# Altium schematic sheet liuyang.SchDoc
size A4
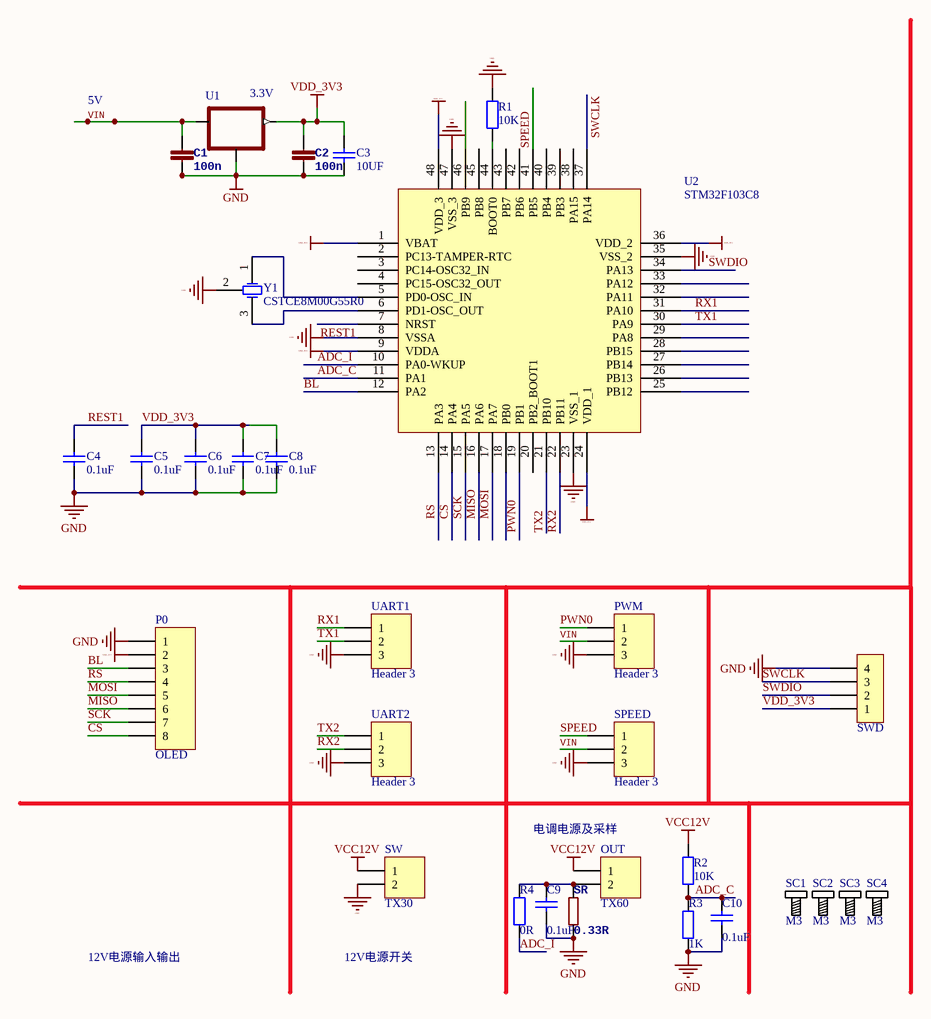
[diagram p0: liuyang.SchDoc]

## Parts
C1  100n  [C0603]
C2  100n  [C0603]
C3  10UF  [C0603]
C4  0.1uF  [C0603]
C5  value 0.1uF  [C0603]  (hidden comment: 10UF)
C6  0.1uF  [C0603]
C7  0.1uF  [C0603]
C8  0.1uF  [C0603]
C9  0.1uF  [C0603]
C10  0.1uF  [C0603]
OUT  TX60  [TX30-m]
P0  OLED  [DF13-1.25-8A]
PWM  Header 3  [DF13-1.25-3A]
R1  10K  [R0603]
R2  10K  [R0603]
R3  value 1K  [R0603]  (hidden comment: 10K)
R4  value 0R  [R0603]  (hidden comment: 10K)
SC1  M3  [SCRREW_M3]
SC2  M3  [SCRREW_M3]
SC3  M3  [SCRREW_M3]
SC4  M3  [SCRREW_M3]
SPEED  Header 3  [DF13-1.25-3A]
SR  0.33R  [R2512]
SW  TX30  [TX30-m]
SWD  CON4  [DF13-1.25-4A]  (value not drawn)
U1  3.3V  [SOT23]
U2  STM32F103C8  [ST_LQFP48]
UART1  Header 3  [DF13-1.25-3A]
UART2  Header 3  [DF13-1.25-3A]
Y1  CSTCE8M00G55R0  [CRYSMD3.2X1.3]

## Nets
GND: C1.2 C2.2 C3.1 C4.1 C5.1 C6.1 C7.1 C8.1 C9.1 C10.1 P0.1 PWM.3 R1.1 R3.2 SPEED.3 SR.2 SW.2 SWD.4 U1.1(GND) U2.8(VSSA) U2.23(VSS_1) U2.35(VSS_2) U2.47(VSS_3) UART1.3 UART2.3 Y1.2(GND)
VCC12V: OUT.1 R2.1 SW.1
VDD_3V3: C2.1 C3.2 C5.2 C6.2 C7.2 C8.2 P0.2 SWD.1 U1.2(OUT) U2.1(VBAT) U2.9(VDDA) U2.24(VDD_1) U2.36(VDD_2) U2.48(VDD_3)
ADC_C: C10.2 R2.2 R3.1 U2.11(PA1)
ADC_I: R4.2 U2.10(PA0-WKUP)
BL: P0.3 U2.12(PA2)
CS: P0.8 U2.14(PA4)
MISO: P0.6 U2.16(PA6)
MOSI: P0.5 U2.17(PA7)
PWN0: PWM.1 U2.19(PB1)
REST1: C4.2 U2.7(NRST)
RS: P0.4 U2.13(PA3)
RX1: U2.31(PA10) UART1.1
RX2: U2.22(PB11) UART2.2
SCK: P0.7 U2.15(PA5)
SPEED: SPEED.1 U2.41(PB5)
SWCLK: SWD.3 U2.37(PA14)
SWDIO: SWD.2 U2.34(PA13)
TX1: U2.30(PA9) UART1.2
TX2: U2.21(PB10) UART2.1
VIN: C1.1 PWM.2 SPEED.2 U1.3(IN)
NetC9_2: C9.2 OUT.2 R4.1 SR.1
NetR1_2: R1.2 U2.44(BOOT0)
NetU2_5: U2.5(PD0-OSC_IN) Y1.1(OSC1)
NetU2_6: U2.6(PD1-OSC_OUT) Y1.3(OSC2)

Not connected (* = marked no-connect by the designer): U2 2(PC13-TAMPER-RTC) 3(PC14-OSC32_IN) 4(PC15-OSC32_OUT) 18(PB0) 20(PB2_BOOT1) 25(PB12) 26(PB13) 27(PB14) 28(PB15) 29(PA8) 32(PA11) 33(PA12) 38(PA15) 39(PB3) 40(PB4) 42(PB6) 43(PB7) 45(PB8) 46(PB9)

## Notes on the sheet
- 5V
- 电调电源及采样
- 12V电源输入输出
- 12V电源开关

## Library data of the parts
C1 C2 = C-EUC0603: CAPACITOR, European symbol
C3-C10 = Cap: Capacitor; Published: 8-Jun-2000; LatestRevisionDate: 17-Jul-2002; LatestRevisionNote: Re-released for DXP Platform.; PackageReference: RAD-0.3; Publisher: Altium Limited
  C3: Value: 10UF
  C4 C6-C10: Value: 0.1uF
OUT SW = Header 2: Header, 2-Pin; LatestRevisionDate: 17-Jul-2002; LatestRevisionNote: Re-released for DXP Platform.; Publisher: Altium Limited
P0 = Header 8: Header, 8-Pin; LatestRevisionDate: 17-Jul-2002; LatestRevisionNote: Re-released for DXP Platform.; Publisher: Altium Limited
PWM SPEED UART1 UART2 = Header 3: Header, 3-Pin; LatestRevisionDate: 17-Jul-2002; LatestRevisionNote: Re-released for DXP Platform.; Publisher: Altium Limited
R1-R4 = Res2: Resistor; Published: 8-Jun-2000; LatestRevisionDate: 17-Jul-2002; LatestRevisionNote: Re-released for DXP Platform.; PackageReference: AXIAL-0.4; Publisher: Altium Limited
  R1 R2: Value: 10K
SC1-SC4 = Screw_M3: Screw
SR = R-EU_R0603: RESISTOR, European symbol
U1 = XC6206
Y1 = XTAL-3